# Altium schematic sheet Sheet1.SchDoc
size A4
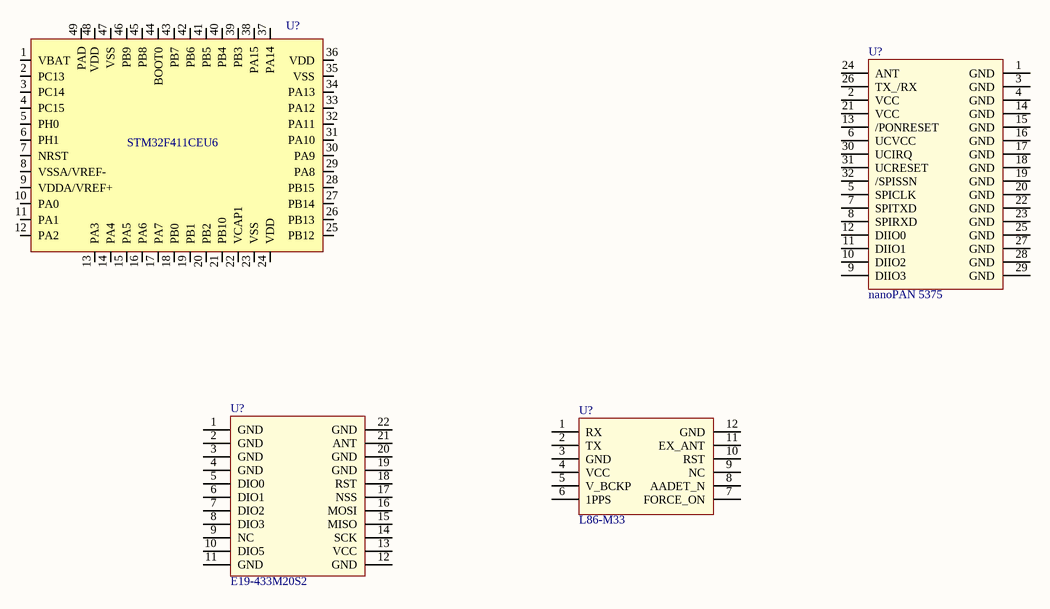
[diagram p0: Sheet1.SchDoc]

## Parts
(Parts that share a designator on the sheet are numbered #1, #2 ... from top to bottom, then left to right.)
U?#1  nanoPAN 5375  [nanoPAN_fp]
U?#2  STM32F411CEU6  [UFQFPN48]  (value not drawn)
U?#3  E19-433M20S2  [E19-433M20S2]
U?#4  L86-M33  [L86-M33]

## Nets

Not connected (* = marked no-connect by the designer): U?#1 1(GND) 2(VCC) 3(GND) 4(GND) 5(SPICLK) 6(UCVCC) 7(SPITXD) 8(SPIRXD) 9(DIIO3) 10(DIIO2) 11(DIIO1) 12(DIIO0) 13(/PONRESET) 14(GND) 15(GND) 16(GND) 17(GND) 18(GND) 19(GND) 20(GND) 21(VCC) 22(GND) 23(GND) 24(ANT) 25(GND) 26(TX_/RX) 27(GND) 28(GND) 29(GND) 30(UCIRQ) 31(UCRESET) 32(/SPISSN); U?#2 1(VBAT) 2(PC13) 3(PC14) 4(PC15) 5(PH0) 6(PH1) 7(NRST) 8(VSSA/VREF-) 9(VDDA/VREF+) 10(PA0) 11(PA1) 12(PA2) 13(PA3) 14(PA4) 15(PA5) 16(PA6) 17(PA7) 18(PB0) 19(PB1) 20(PB2) 21(PB10) 22(VCAP1) 23(VSS) 24(VDD) 25(PB12) 26(PB13) 27(PB14) 28(PB15) 29(PA8) 30(PA9) 31(PA10) 32(PA11) 33(PA12) 34(PA13) 35(VSS) 36(VDD) 37(PA14) 38(PA15) 39(PB3) 40(PB4) 41(PB5) 42(PB6) 43(PB7) 44(BOOT0) 45(PB8) 46(PB9) 47(VSS) 48(VDD) 49(PAD); U?#3 1(GND) 2(GND) 3(GND) 4(GND) 5(DIO0) 6(DIO1) 7(DIO2) 8(DIO3) 9(NC) 10(DIO5) 11(GND) 12(GND) 13(VCC) 14(SCK) 15(MISO) 16(MOSI) 17(NSS) 18(RST) 19(GND) 20(GND) 21(ANT) 22(GND); U?#4 1(RX) 2(TX) 3(GND) 4(VCC) 5(V_BCKP) 6(1PPS) 7(FORCE_ON) 8(AADET_N) 9(NC) 10(RST) 11(EX_ANT) 12(GND)

## Library data of the parts
U?#1 = nanoPAN
U?#2 = STM32F411CEU6: ComponentLink1Description: STM32F411CEU6; ComponentLink1URL: https://lcsc.com/product-detail/ST-Microelectronics_STMicroelectronics_STM32F411CEU6_STM32F411CEU6_C60420.html